# Altium schematic sheet 01_MCU_ESP32C6.SchDoc
size 420 x 297 mm; Author: Войлоков В. В.; CompanyName: ВГТУ РП-233; Organization: ВГТУ; SheetNumber: 1; SheetTotal: 5; DecimalNumber: ВГТУ.436224.001; Name1: Микроконтроллер.; Name2: Схема управления
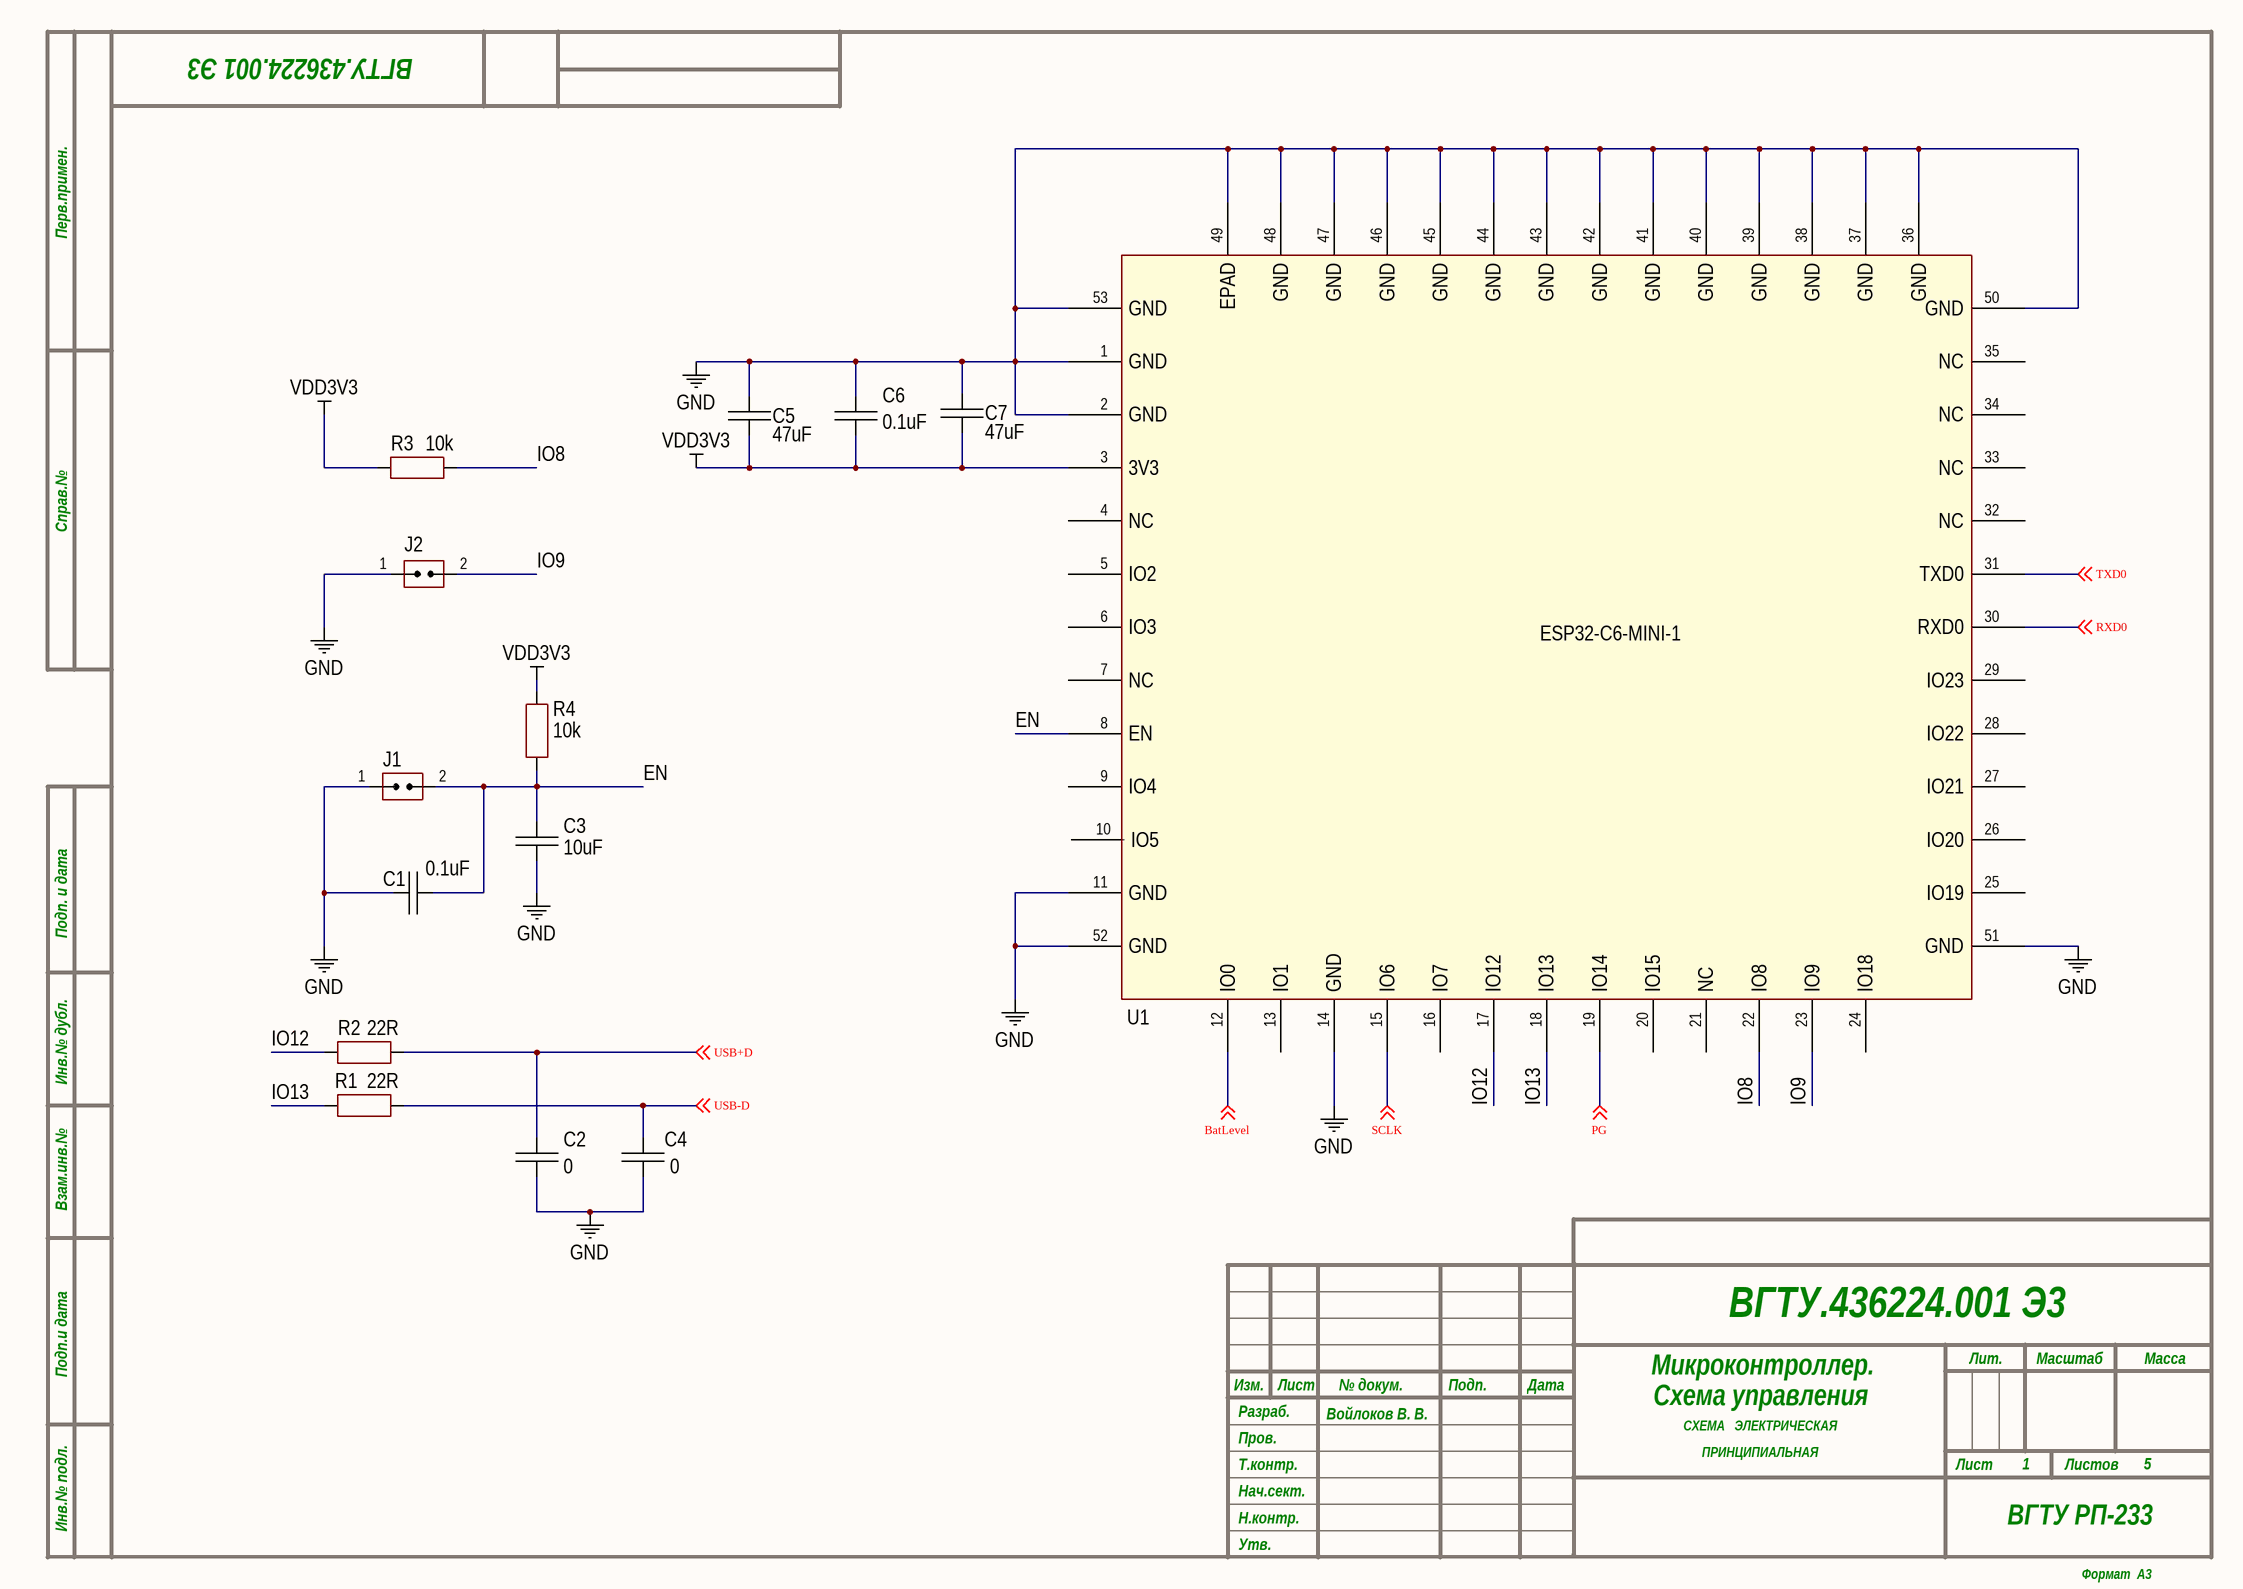
[diagram p0: 01_MCU_ESP32C6.SchDoc]

## Parts
C1  value 0.1uF  [CAP: 0603]
C2  value 0  [CAP: 0603]
C3  value 10uF  [CAP: 0603]
C4  value 0  [CAP: 0603]
C5  value 47uF  [CAP: 0805]
C6  value 0.1uF  [CAP: 0603]
C7  value 47uF  [CAP: 0805]
J1  (no value)  [CON: JUMPER x1]
J2  (no value)  [CON: JUMPER x1]
R1  value 22R  [RES: 0603]
R2  value 22R  [RES: 0603]
R3  value 10k  [RES: 0603]
R4  value 10k  [RES: 0603]
U1  ESP32-C6-MINI-1  [ESP32-C6_EXP]

## Nets
GND: C1.2 C2.2 C3.1 C4.2 C5.2 C6.2 C7.2 J1.1(IN) J2.1(IN) U1.1(GND) U1.2(GND) U1.11(GND) U1.14(GND) U1.36(GND) U1.37(GND) U1.38(GND) U1.39(GND) U1.40(GND) U1.41(GND) U1.42(GND) U1.43(GND) U1.44(GND) U1.45(GND) U1.46(GND) U1.47(GND) U1.48(GND) U1.49(EPAD) U1.50(GND) U1.51(GND) U1.52(GND) U1.53(GND)
VDD3V3: C5.1 C6.1 C7.1 R3.2 R4.2 U1.3(3V3)
BatLevel: U1.12(IO0) ; off-sheet BatLevel
EN: C1.1 C3.2 J1.2(IN) R4.1 U1.8(EN)
IO8: R3.1 U1.22(IO8)
IO9: J2.2(IN) U1.23(IO9)
IO12: R2.2 U1.17(IO12)
IO13: R1.2 U1.18(IO13)
PG: U1.19(IO14) ; off-sheet PG
RXD0: U1.30(RXD0) ; off-sheet RXD0
SCLK: U1.15(IO6) ; off-sheet SCLK
TXD0: U1.31(TXD0) ; off-sheet TXD0
USB+D: C2.1 R2.1 ; off-sheet USB+D
USB-D: C4.1 R1.1 ; off-sheet USB-D

Not connected (* = marked no-connect by the designer): U1 4(NC) 5(IO2) 6(IO3) 7(NC) 9(IO4) 10(IO5) 13(IO1) 16(IO7) 20(IO15) 21(NC) 24(IO18) 25(IO19) 26(IO20) 27(IO21) 28(IO22) 29(IO23) 32(NC) 33(NC) 34(NC) 35(NC)

## Notes on the sheet
- Перв.примен.
- Справ.№
- Подп. и дата
- Инв.№ дубл.
- Взам.инв.№
- Подп.и дата
- Разраб.
- Изм.
- Лист
- № докум.
- Подп.
- Дата
- Лит.
- Масштаб
- Масса
- Т.контр.
- Пров.
- СХЕМА   ЭЛЕКТРИЧЕСКАЯ
- ПРИНЦИПИАЛЬНАЯ
- Листов
- Инв.№ подл.
- Утв.
- Н.контр.
- Нач.сект.
- Формат  A3

## Library data of the parts
C1 C6 = Ceramic_0603: Manufacturer: Yageo; PartNumber: CC0603KRX7R7BB104; ValueManufacturerPartNumber: Ceramic capacitor, 0.1uF, X7R, ±10%, 16V, 0603, -55...+125°C; TypeCapacitor: Ceramic capacitor; Tolerance: ±10%; TypeDielectric: X7R; Voltage: 16V; Package: 0603; HelpURL: https://www.digikey.com/product-detail/en/yageo/CC0603KRX7R7BB104/311-1088-1-ND/302998; Temperature: -55...+125°C
C2 C4 = Ceramic_0603: Manufacturer: Yageo; PartNumber: CC0603KRX7R7BB104; ValueManufacturerPartNumber: Ceramic capacitor, 0, X7R, ±10%, 16V, 0603, -55...+125°C; TypeCapacitor: Ceramic capacitor; Tolerance: ±10%; TypeDielectric: X7R; Voltage: 16V; Package: 0603; HelpURL: https://www.digikey.com/product-detail/en/yageo/CC0603KRX7R7BB104/311-1088-1-ND/302998; Temperature: -55...+125°C
C3 = Ceramic_0603: Manufacturer: Yageo; PartNumber: CC0603KRX7R7BB104; ValueManufacturerPartNumber: Ceramic capacitor, 10uF, X7R, ±10%, 16V, 0603, -55...+125°C; TypeCapacitor: Ceramic capacitor; Tolerance: ±10%; TypeDielectric: X7R; Voltage: 16V; Package: 0603; HelpURL: https://www.digikey.com/product-detail/en/yageo/CC0603KRX7R7BB104/311-1088-1-ND/302998; Temperature: -55...+125°C
C5 C7 = Ceramic_0805: Manufacturer: Yageo; PartNumber: CC0805KRX7R7BB104; ValueManufacturerPartNumber: Ceramic capacitor, 47uF, X7R, ±10%, 16V, 0805, -55...+125°C; TypeCapacitor: Ceramic capacitor; Tolerance: ±10%; TypeDielectric: X7R; Voltage: 16V; Package: 0805; HelpURL: https://www.digikey.com/product-detail/en/yageo/CC0805KRX7R7BB104/311-1142-1-ND/303052; Temperature: -55...+125°C
J1 J2 = Jumper_single: CommentText: "Перемычка"
R1 R2 = Resistor_0603: Manufacturer: Yageo; PartNumber: RC0603JR-07100RL; ValueManufacturerPartNumber: Resistor film, 22R, ±5%, 0603, 0.1W, -55...+125°C; TypeResistor: Resistor film; Power: 0.1W; Tolerance: ±5%; Package: 0603; HelpURL: https://www.digikey.com/product-detail/en/yageo/RC0603JR-07100RL/311-100GRCT-ND/729644; Temperature: -55...+125°C
R3 R4 = Resistor_0603: Manufacturer: Yageo; PartNumber: RC0603JR-07100RL; ValueManufacturerPartNumber: Resistor film, 10k, ±5%, 0603, 0.1W, -55...+125°C; TypeResistor: Resistor film; Power: 0.1W; Tolerance: ±5%; Package: 0603; HelpURL: https://www.digikey.com/product-detail/en/yageo/RC0603JR-07100RL/311-100GRCT-ND/729644; Temperature: -55...+125°C